# EAGLE design IVSTAGEV15 (EAGLE 5.07)
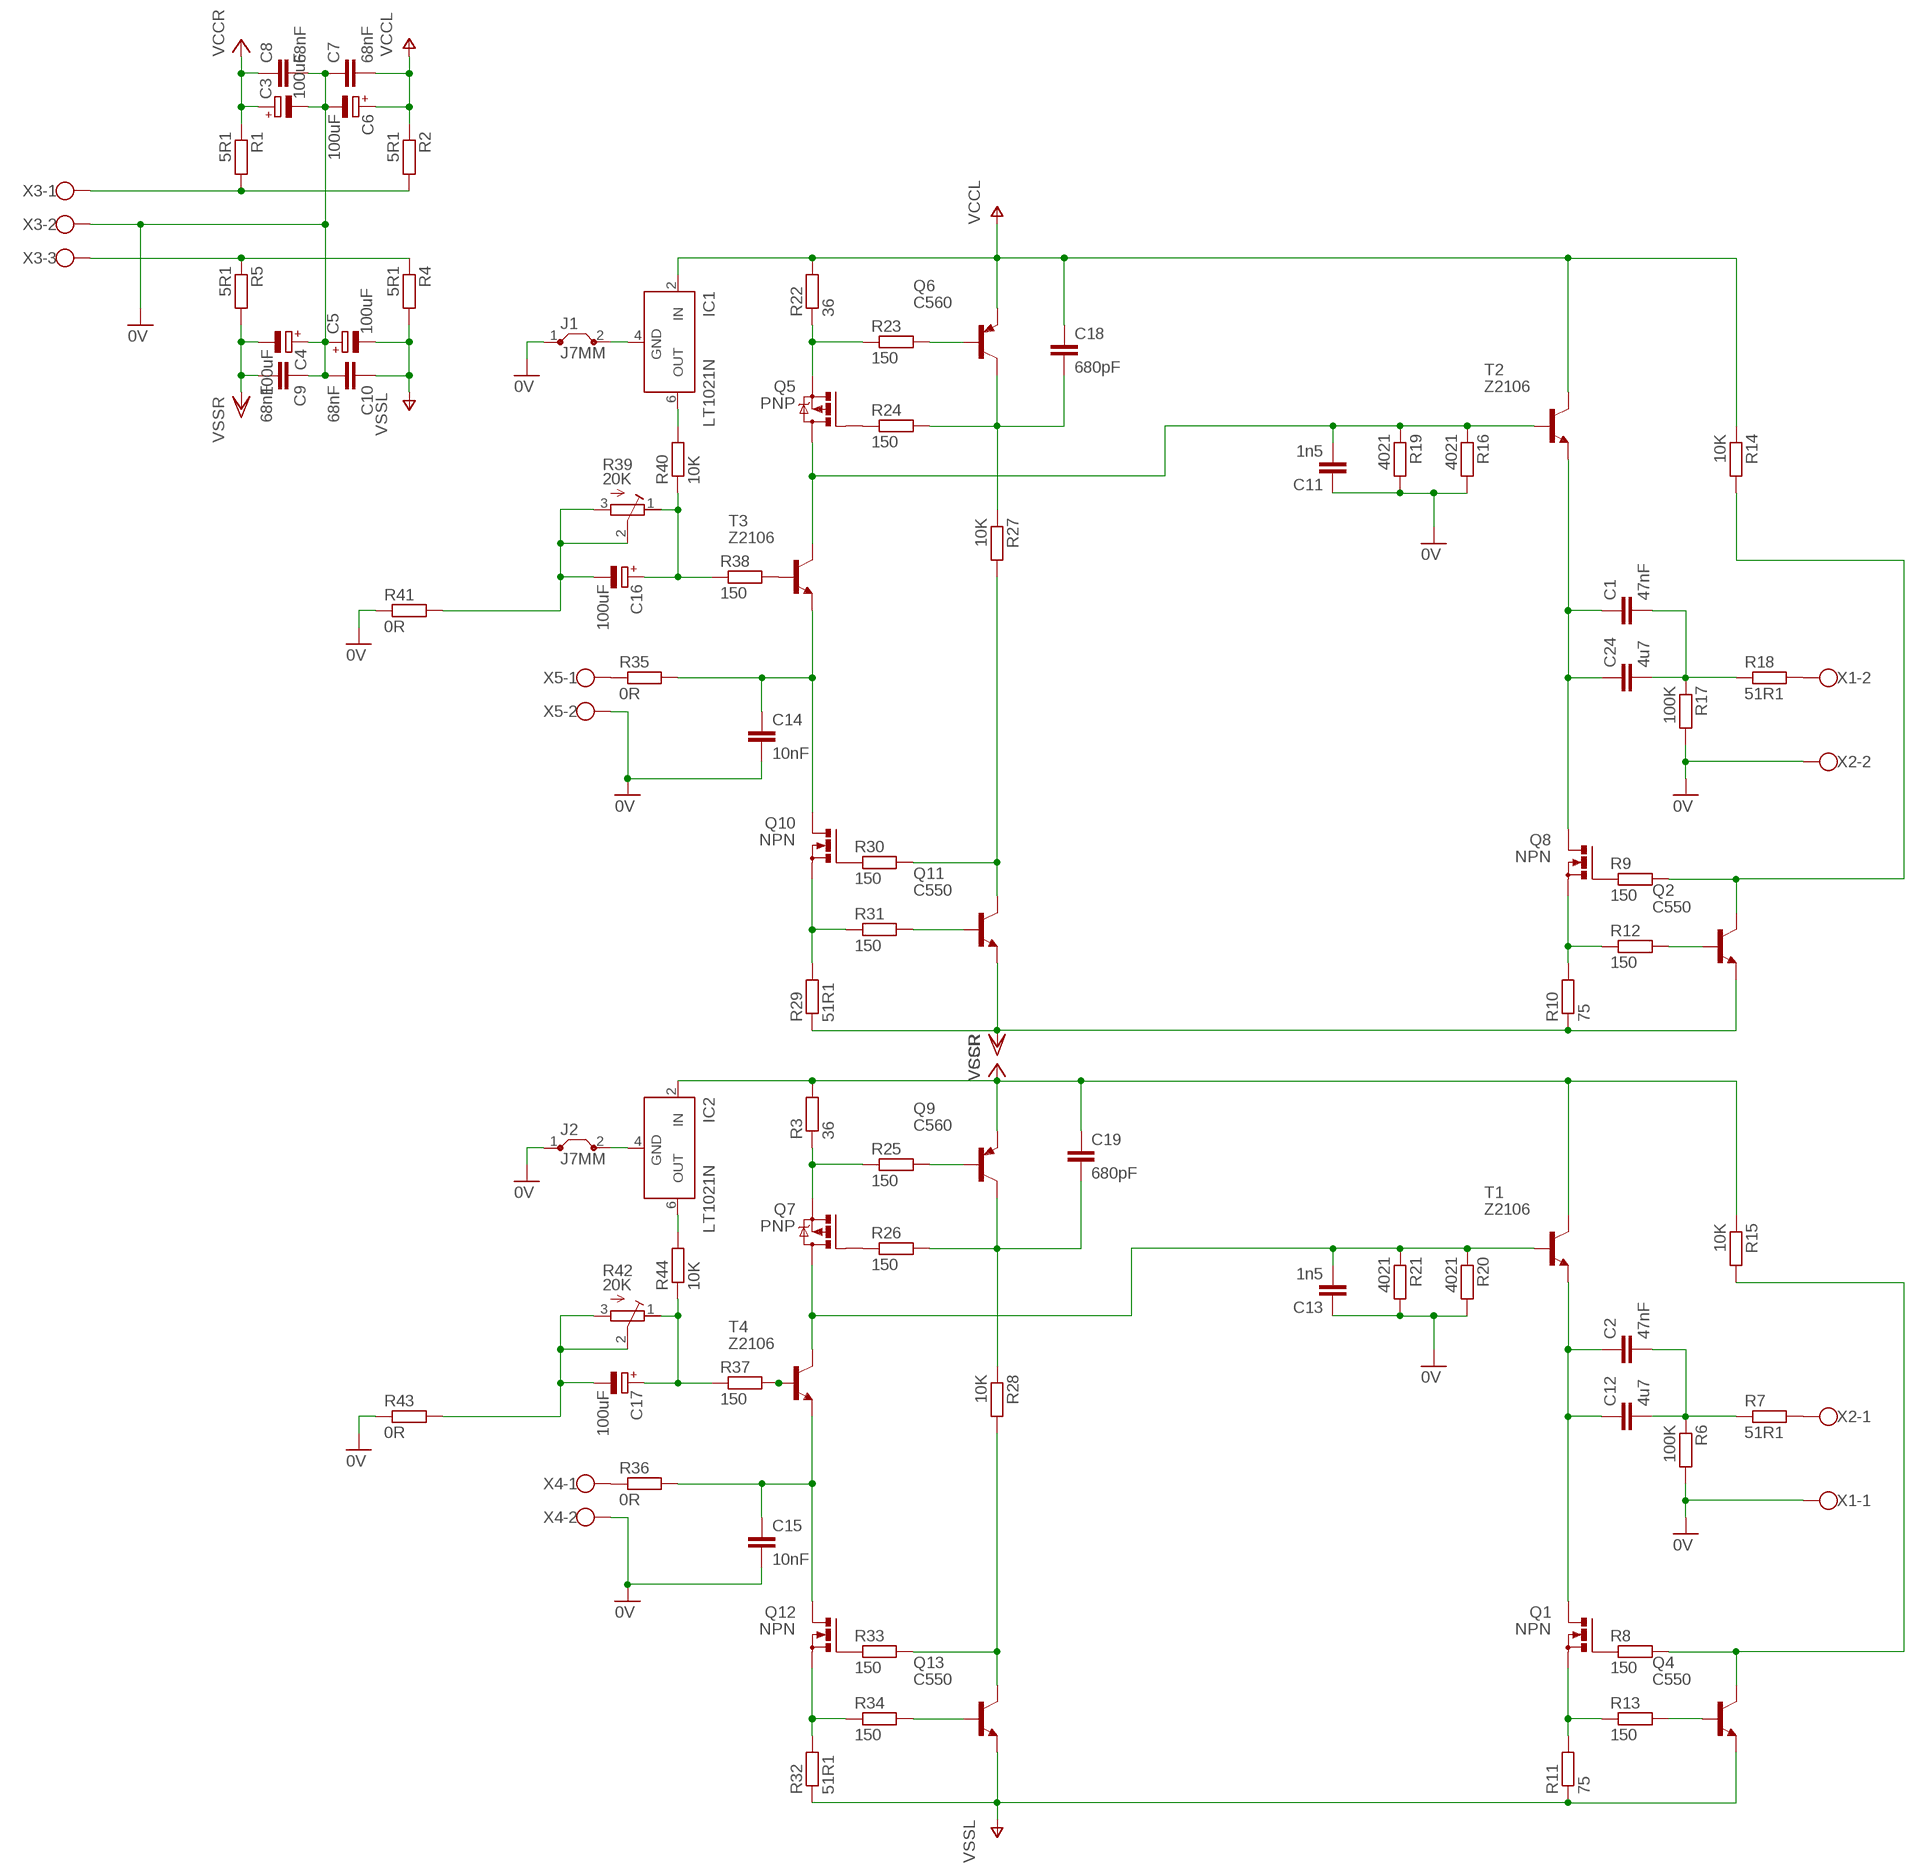
[diagram p0: schematic, sheet 1]

## Parts
C1  47nF  C-EU050-050X075  [C050-050X075]
C2  47nF  C-EU050-050X075  [C050-050X075]
C3  100uF  CPOL-EUE5-13  [E5-13]
C4  100uF  CPOL-EUE5-13  [E5-13]
C5  100uF  CPOL-EUE5-13  [E5-13]
C6  100uF  CPOL-EUE5-13  [E5-13]
C7  68nF  C-EU050-035X075  [C050-035X075]
C8  68nF  C-EU050-035X075  [C050-035X075]
C9  68nF  C-EU050-035X075  [C050-035X075]
C10  68nF  C-EU050-035X075  [C050-035X075]
C11  1n5  C-EU050-035X075  [C050-035X075]
C12  4u7  C37/19  [C37.5B19]
C13  1n5  C-EU050-035X075  [C050-035X075]
C14  10nF  C-EU050-050X075  [C050-050X075]
C15  10nF  C-EU050-050X075  [C050-050X075]
C16  100uF  CPOL-EUE5-10.5  [E5-10,5]
C17  100uF  CPOL-EUE5-10.5  [E5-10,5]
C18  680pF  C-EU050-045X075  [C050-045X075]
C19  680pF  C-EU050-045X075  [C050-045X075]
C24  4u7  C37/19  [C37.5B19]
IC1  LT1021N  [DIL08]
IC2  LT1021N  [DIL08]
J1  J7MM  [07]
J2  J7MM  [07]
Q1  NPN  PMOSFET_NTO220BV  [TO220BV]
Q2  C550  BC550B  [TO92-EBC]
Q4  C550  BC550B  [TO92-EBC]
Q5  PNP  IRF9530  [TO220BV]
Q6  C560  BC560  [TO92-EBC]
Q7  PNP  IRF9530  [TO220BV]
Q8  NPN  PMOSFET_NTO220BV  [TO220BV]
Q9  C560  BC560  [TO92-EBC]
Q10  NPN  PMOSFET_NTO220BV  [TO220BV]
Q11  C550  BC550B  [TO92-EBC]
Q12  NPN  PMOSFET_NTO220BV  [TO220BV]
Q13  C550  BC550B  [TO92-EBC]
R1  5R1  R-EU_0207/7  [0207/7]
R2  5R1  R-EU_0207/7  [0207/7]
R3  36  R-EU_0207/7  [0207/7]
R4  5R1  R-EU_0207/7  [0207/7]
R5  5R1  R-EU_0207/7  [0207/7]
R6  100K  R-EU_0204/7  [0204/7]
R7  51R1  R-EU_0207/7  [0207/7]
R8  150  R-EU_0207/7  [0207/7]
R9  150  R-EU_0207/7  [0207/7]
R10  75  R-EU_0207/7  [0207/7]
R11  75  R-EU_0207/7  [0207/7]
R12  150  R-EU_0207/7  [0207/7]
R13  150  R-EU_0207/7  [0207/7]
R14  10K  R-EU_0309/12  [0309/12]
R15  10K  R-EU_0309/12  [0309/12]
R16  4021  R-EU_0309/12  [0309/12]
R17  100K  R-EU_0204/7  [0204/7]
R18  51R1  R-EU_0207/7  [0207/7]
R19  4021  R-EU_0309/12  [0309/12]
R20  4021  R-EU_0309/12  [0309/12]
R21  4021  R-EU_0309/12  [0309/12]
R22  36  R-EU_0207/7  [0207/7]
R23  150  R-EU_0207/10  [0207/10]
R24  150  R-EU_0207/7  [0207/7]
R25  150  R-EU_0207/10  [0207/10]
R26  150  R-EU_0207/10  [0207/10]
R27  10K  R-EU_0309/12  [0309/12]
R28  10K  R-EU_0309/12  [0309/12]
R29  51R1  R-EU_0207/7  [0207/7]
R30  150  R-EU_0207/7  [0207/7]
R31  150  R-EU_0207/7  [0207/7]
R32  51R1  R-EU_0207/7  [0207/7]
R33  150  R-EU_0207/7  [0207/7]
R34  150  R-EU_0207/7  [0207/7]
R35  0R  R-EU_0207/7  [0207/7]
R36  0R  R-EU_0207/7  [0207/7]
R37  150  R-EU_0204/7  [0204/7]
R38  150  R-EU_0204/7  [0204/7]
R39  20K  R-TRIMMT93YA  [RTRIMT93YA]
R40  10K  R-EU_0207/10  [0207/10]
R41  0R  R-EU_0207/10  [0207/10]
R42  20K  R-TRIMMT93YA  [RTRIMT93YA]
R43  0R  R-EU_0207/10  [0207/10]
R44  10K  R-EU_0207/10  [0207/10]
T1  Z2106  BC337-NPN-TO92-EBC  [TO92-EBC]
T2  Z2106  BC337-40-NPN-TO92-EBC  [TO92-EBC]
T3  Z2106  BC337-NPN-TO92-EBC  [TO92-EBC]
T4  Z2106  BC337-40-NPN-TO92-EBC  [TO92-EBC]
X1  W237-02P  [W237-132]
X2  W237-02P  [W237-132]
X3  W237-03P  [W237-133]
X4  W237-02P  [W237-132]
X5  W237-02P  [W237-132]

## Nets
0V: C3.- C4.+ C5.+ C6.- C7.1 C8.2 C9.1 C10.2 C11.1 C13.1 C14.2 C15.2 J1.1 J2.1 R6.2 R16.2 R17.2 R19.2 R20.2 R21.2 R41.1 R43.1 X1.1 X2.2 X3.2 X4.2 X5.2
N$1: R18.2 X1.2
N$2: R7.2 X2.1
N$3: C2.1 C12.1 Q1.D T1.E
N$4: C1.1 C24.1 Q8.D T2.E
N$5: Q8.S R10.2 R12.1
N$6: R1.2 R2.2 X3.1
N$7: R4.1 R5.1 X3.3
N$8: Q1.S R11.2 R13.1
N$9: Q2.B R12.2
N$11: C2.2 C12.2 R6.1 R7.1
N$12: Q2.C R9.2 R14.2
N$13: Q1.G R8.1
N$14: Q8.G R9.1
N$15: Q4.C R8.2 R15.2
N$16: Q4.B R13.2
N$17: C13.2 Q7.D R20.1 R21.1 T1.B T4.C
N$18: C11.2 Q5.D R16.1 R19.1 T2.B T3.C
N$19: Q6.B R23.2
N$20: C18.2 Q6.C R24.2 R27.1
N$21: Q5.S R22.1 R23.1
N$22: Q7.S R3.1 R25.1
N$23: Q5.G R24.1
N$24: C1.2 C24.2 R17.1 R18.1
N$25: Q7.G R26.1
N$26: Q9.B R25.2
N$27: C19.2 Q9.C R26.2 R28.1
N$28: R38.2 T3.B
N$29: Q12.S R32.2 R34.1
N$30: R35.1 X5.1
N$31: Q10.S R29.2 R31.1
N$32: Q10.G R30.1
N$33: Q11.C R27.2 R30.2
N$34: Q12.G R33.1
N$35: Q11.B R31.2
N$36: Q13.C R28.2 R33.2
N$37: Q13.B R34.2
N$38: R36.1 X4.1
N$39: C14.1 Q10.D R35.2 T3.E
N$40: C15.1 Q12.D R36.2 T4.E
N$41: C16.+ R38.1 R39.1(A) R40.1
N$42: IC1.6(OUT) R40.2
N$43: IC1.4(GND) J1.2
N$44: C17.+ R37.1 R42.1(A) R44.1
N$45: C16.- R39.2(S) R39.3(E) R41.2
N$46: C17.- R42.2(S) R42.3(E) R43.2
N$47: R37.2 T4.B
N$48: IC2.6(OUT) R44.2
N$49: IC2.4(GND) J2.2
V+: C6.+ C7.2 C18.1 IC1.2(IN) Q6.E R2.1 R14.1 R22.2 T2.C ; supply symbol labelled VCCL
V-: C5.- C10.1 Q4.E Q13.E R4.2 R11.1 R32.1 ; supply symbol labelled VSSL
VCC: C3.+ C8.1 C19.1 IC2.2(IN) Q9.E R1.1 R3.2 R15.1 T1.C ; supply symbol labelled VCCR
VSS: C4.- C9.2 Q2.E Q11.E R5.2 R10.1 R29.1 ; supply symbol labelled VSSR

## Library data of the parts
C1 C2 C7-C11 C13-C15 C18 C19 = resistor:C-EU: CAPACITOR, European symbol
C3-C6 C16 C17 = resistor:CPOL-EU: POLARIZED CAPACITOR, European symbol
C12 C24 = capacitor-wima:C: CAPACITOR naming: grid - package width
IC1 IC2 = linear-technology:LT1021: Precision Reference Source: http://www.linear.com/pc/downloadDocument.do?navId=H0,C1,C1010,C1603,P1229,D2805
J1 J2 = jumper:J: Bridge
Q1 Q8 Q10 Q12 = transistor-power:PMOSFET_N: Power MOSFET N-Channel
Q2 Q4 Q11 Q13 = transistor-npn:BC550*: NPN Transistor
Q5 Q7 = transistor-power:IRF9530: P-CHANNEL HEXFET POWER-MOS-FET Source: http://www.irf.com/product-info/datasheets/data/irf9530.pdf
Q6 Q9 = transistor-pnp:BC560*: PNP Transistror
R1-R38 R40 R41 R43 R44 = resistor:R-EU_: RESISTOR, European symbol
R39 R42 = resistor:R-TRIMM: Trimm resistor
T1-T4 = transistor:*-NPN-: NPN Transistror BF959 corrected 2008.03.06
X1 X2 X4 X5 = con-wago-508:W237-02P: WAGO SREW CLAMP
X3 = con-wago-508:W237-03P: WAGO SREW CLAMP

## Board
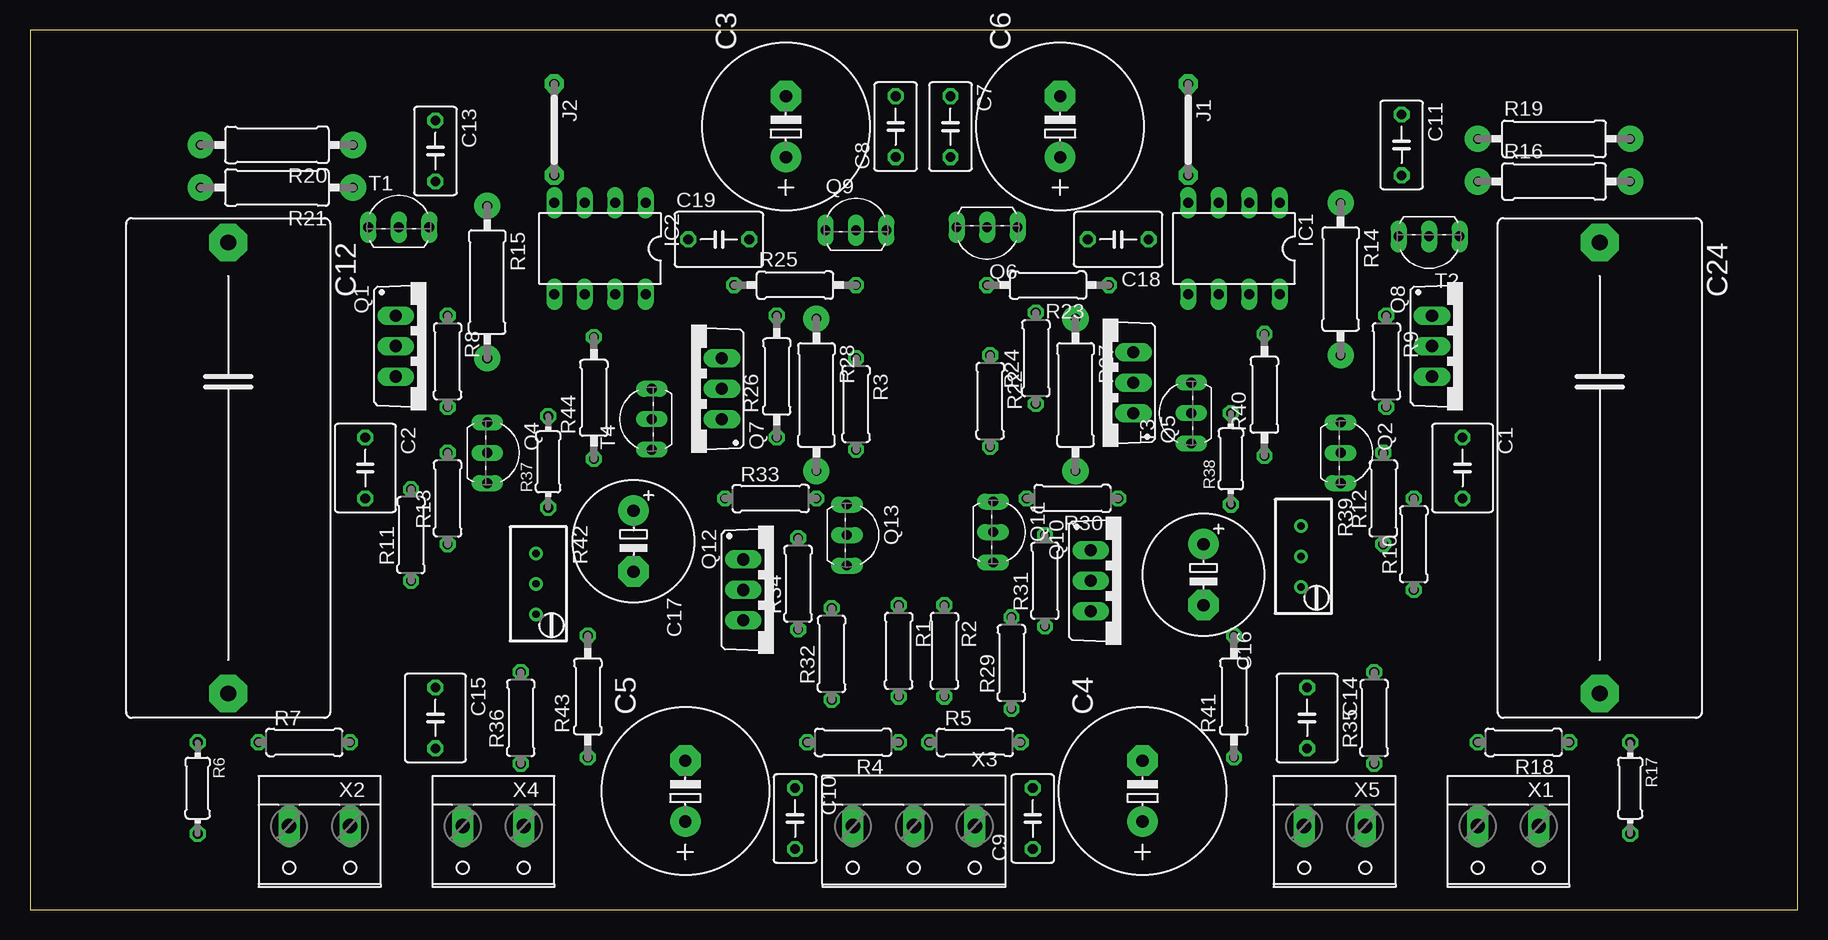
[diagram p1: board, top side]
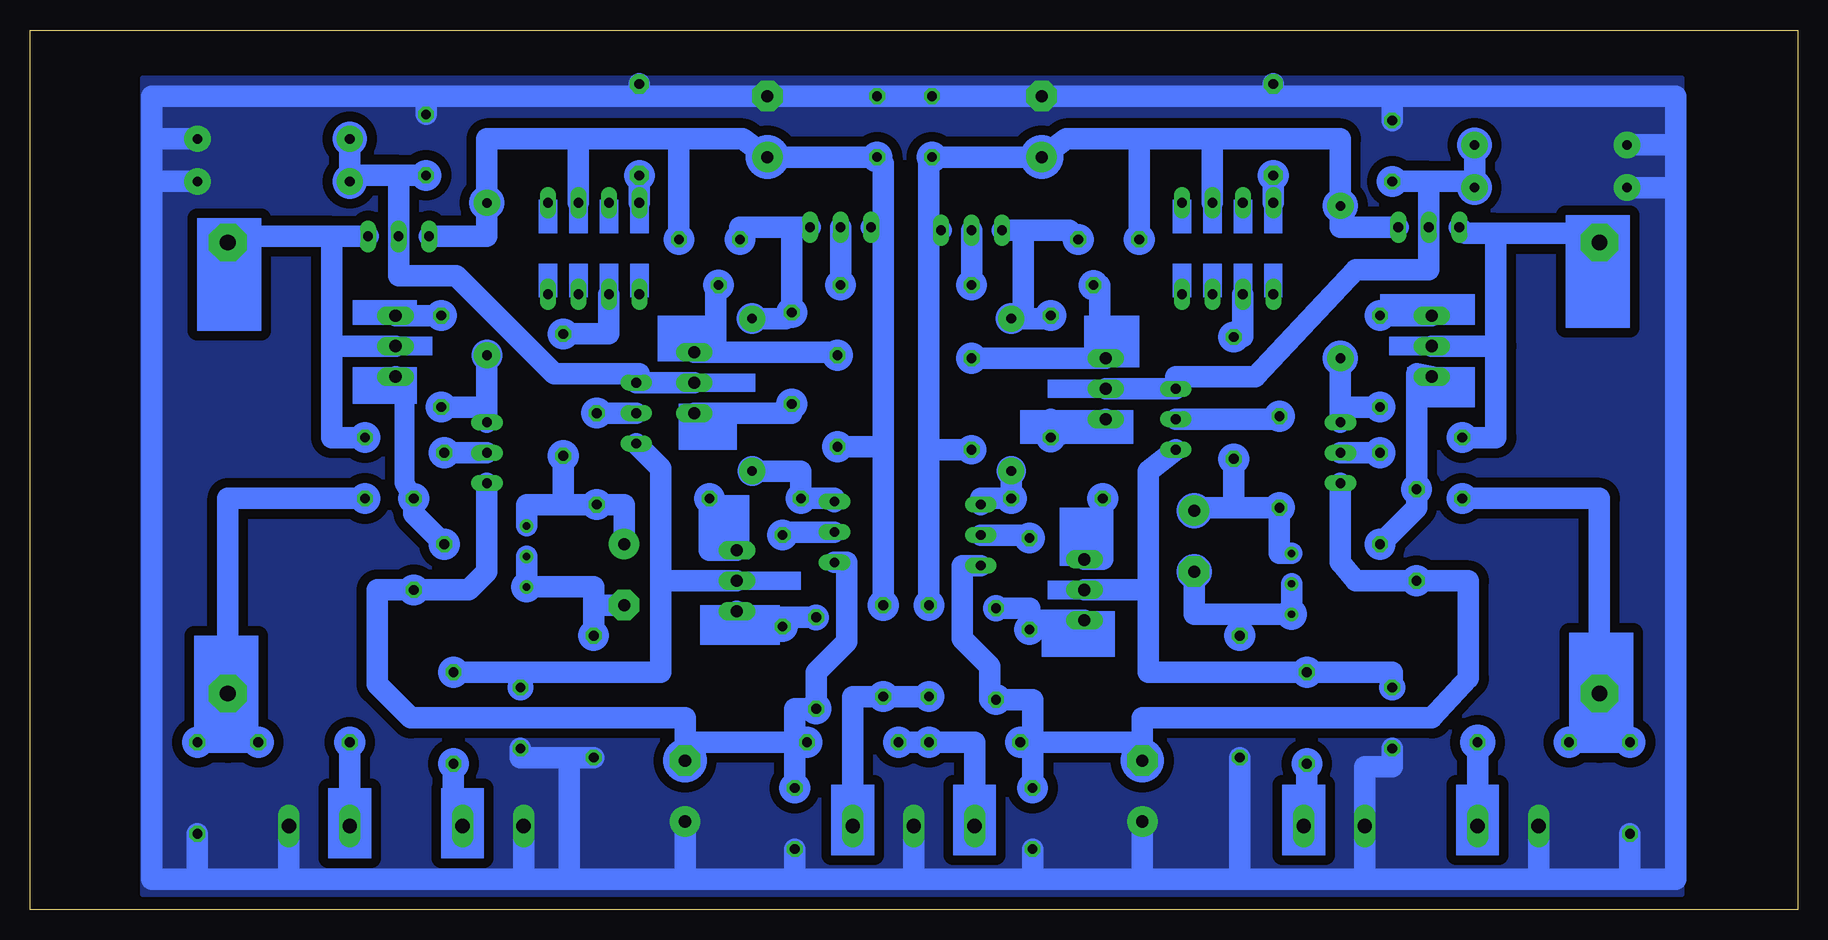
[diagram p2: board, bottom side, seen from below]

Size 147.3 x 73.33 mm. Coordinates in mm from the lower left corner, seen from the top.
Outline: 0,0 147.3,0 147.3,73.33 0,73.33 0,0
Copper layers (1*16): Top 0.035mm / dielectric 1.5mm / Bottom 0.035mm
Design rules "default": minimum track width 10mil, minimum drill 24mil, track to track 8mil, track to pad 8mil, pad to pad 8mil, via to via 8mil, smd to smd 8mil, copper to edge 40mil, drill to drill 8mil, minimum pad ring 10mil, minimum via ring 8mil, stop-mask expansion 4mil, vias tented up to drill 0mil, thermal gap 10mil

### Footprints (pad centres in the part's own frame; a part is rotated, then mirrored left to right if it is on the bottom)
C050-050X075 = drill 0.813 octagon: 1 -2.54,0; 2 2.54,0
E5-13 = drill 1.016 pad 2.54 round: + -2.54,0 | drill 1.016 pad 2.54 octagon: - 2.54,0
C050-035X075 = drill 0.813 octagon: 1 -2.54,0; 2 2.54,0
C37.5B19 = drill 1.321 pad 3.15 octagon: 1 -18.796,0; 2 18.796,0
E5-10,5 = drill 1.016 pad 2.54 round: + -2.54,0 | drill 1.016 pad 2.54 octagon: - 2.54,0
C050-045X075 = drill 0.813 octagon: 1 -2.54,0; 2 2.54,0
DIL08 = drill 0.813 long: 1 -3.81,-3.81; 2 -1.27,-3.81; 3 1.27,-3.81; 4 3.81,-3.81; 5 3.81,3.81; 6 1.27,3.81; 7 -1.27,3.81; 8 -3.81,3.81
07 = drill 0.813 pad 1.6 octagon: 1 -3.81,0; 2 3.81,0
TO220BV = drill 1.016 long: D 0,-2.54; G -2.54,-2.54; S 2.54,-2.54
TO92-EBC = drill 0.813 long: B 0,-1.27; C -2.54,-1.27; E 2.54,-1.27
0207/7 = drill 0.813 octagon: 1 -3.81,0; 2 3.81,0
0204/7 = drill 0.813 octagon: 1 -3.81,0; 2 3.81,0
0309/12 = drill 0.8 pad 2.184 round: 1 -6.35,0; 2 6.35,0
0207/10 = drill 0.813 octagon: 1 -5.08,0; 2 5.08,0
RTRIMT93YA = drill 0.61 round: 1 0,-2.54; 2 0,0; 3 0,2.54
TO92-EBC' = drill 0.813 long: B 0,-1.27; C 2.54,-1.27; E -2.54,-1.27
W237-132 = drill 1.194 long: 1 -2.54,-0.635; 2 2.54,-0.635
W237-133 = drill 1.194 long: 1 -5.08,-0.635; 2 0,-0.635; 3 5.08,-0.635

### Placement (x,y rotation side)
C1  119.38,36.83 270 top
C2  27.94,36.83 270 top
C3  62.99,65.28 90 top
C4  92.71,9.91 90 top
C5  54.61,9.91 90 top
C6  85.85,65.28 90 top
C7  76.71,65.28 270 top
C8  72.14,65.28 90 top
C9  83.57,7.62 90 top
C10  63.75,7.62 270 top
C11  114.3,63.75 270 top
C12  16.51,36.83 270 top
C13  33.78,63.25 270 top
C14  106.43,16 270 top
C15  33.78,16 270 top
C16  97.79,27.94 270 top
C17  50.29,30.73 270 top
C18  90.68,55.88 180 top
C19  57.4,55.88 0 top
C24  130.81,36.83 270 top
IC1  100.33,55.12 180 top
IC2  47.5,55.12 180 top
J1  96.52,65.02 270 top
J2  43.69,65.02 270 top
Q1  33.02,46.99 270 top
Q2  110.49,38.1 270 top
Q4  39.37,38.1 270 top
Q5  89.41,43.94 90 top
Q6  79.76,55.63 180 top
Q7  55.12,43.43 90 top
Q8  119.38,46.99 270 top
Q9  68.83,57.91 0 top
Q10  90.93,27.43 270 top
Q11  81.53,31.5 270 top
Q12  61.98,26.67 270 top
Q13  69.34,31.24 270 top
R1  72.39,21.59 270 top
R2  76.2,21.59 270 top
R3  68.83,42.16 270 top
R4  68.58,13.97 180 top
R5  78.74,13.97 0 top
R6  13.97,10.16 270 top
R7  22.86,13.97 0 top
R8  34.8,45.72 270 top
R9  113.03,45.72 270 top
R10  115.32,30.48 90 top
R11  31.75,31.24 90 top
R12  112.78,34.29 90 top
R13  34.8,34.29 90 top
R14  109.22,52.58 270 top
R15  38.1,52.32 270 top
R16  127,60.71 0 top
R17  133.35,10.16 270 top
R18  124.46,13.97 180 top
R19  127,64.26 0 top
R20  20.57,63.75 180 top
R21  20.57,60.2 180 top
R22  80.01,42.42 270 top
R23  84.84,52.07 180 top
R24  83.82,45.97 90 top
R25  63.75,52.07 0 top
R26  62.23,44.45 90 top
R27  87.12,42.93 270 top
R28  65.53,42.93 270 top
R29  81.79,20.57 90 top
R30  86.87,34.29 180 top
R31  84.58,27.43 90 top
R32  66.8,21.34 90 top
R33  61.72,34.29 0 top
R34  64.01,27.18 90 top
R35  112.01,16 90 top
R36  40.89,16 90 top
R37  43.18,37.34 90 top
R38  100.08,37.59 90 top
R39  105.92,29.46 180 top
R40  102.87,42.93 90 top
R41  100.33,17.78 90 top
R42  42.16,27.18 180 top
R43  46.48,17.78 90 top
R44  46.99,42.67 90 top
T1  Z2106  [TO92-EBC']  30.73,58.17 0 top
T2  Z2106  [TO92-EBC']  116.59,54.86 180 top
T3  Z2106  [TO92-EBC']  95.5,41.4 90 top
T4  Z2106  [TO92-EBC']  50.55,40.89 90 top
X1  123.19,6.35 180 top
X2  24.13,6.35 180 top
X3  73.66,6.35 180 top
X4  38.61,6.35 180 top
X5  108.71,6.35 180 top

### Tracks (layer width: path | path; a pad name or v marks a point on that pad's centre or on a via)
0V
  Bottom 1.778: 13.97,2.54 R6.2 | 13.97,2.54 21.59,2.54 | 21.59,2.54 36.07,2.54 | 36.07,2.54 46.48,2.54 | 46.48,2.54 54.61,2.54 | 54.61,2.54 63.75,2.54 | 63.75,2.54 73.66,2.54 | 73.66,2.54 83.57,2.54 | 83.57,2.54 92.71,2.54 | 92.71,2.54 102.36,2.54 | 102.36,2.54 106.17,2.54 | 106.17,2.54 125.73,2.54 | 125.73,2.54 X1.1 | 133.35,2.54 R17.2 | 125.73,2.54 133.35,2.54 | 21.59,2.54 X2.2 | 54.61,2.54 C5.+ | 73.66,2.54 X3.2 | 92.71,2.54 C4.+ | 96.52,67.82 C6.- C7.1 C8.2 C3.- 43.69,67.82 | 96.52,67.82 114.3,67.82 | 114.3,67.82 137.16,67.82 137.16,64.26 | 137.16,60.71 137.16,2.54 133.35,2.54 | 33.78,67.82 10.16,67.82 10.16,63.75 | 33.78,67.82 43.69,67.82 | 10.16,60.2 10.16,2.54 13.97,2.54 | 10.16,60.2 10.16,63.75 | 63.75,2.54 C10.2 | 83.57,2.54 C9.1 | 10.16,60.2 R21.2 | 10.16,63.75 R20.2 | 33.78,67.82 C13.1 | 114.3,67.82 C11.1 | 137.16,64.26 R19.2 | 137.16,60.71 R16.2 | 137.16,64.26 137.16,60.71 | 36.07,2.54 X4.2 36.07,11.94 33.78,11.94 C15.2 | 106.17,2.54 X5.2 | C14.2 106.43,12.7 R41.1 102.36,12.7 102.36,2.54 | 96.52,67.82 J1.1 | 43.69,67.82 J2.1 | 46.48,2.54 R43.1
  pour Bottom (isolate 0.813, no thermals): 9.65,69.34 9.65,1.27 137.92,1.27 137.92,69.34
N$1
  Bottom 1.778: R18.2 X1.2 120.65,6.35
N$2
  Bottom 1.778: X2.1 R7.2
N$3
  Bottom 1.778: C12.1 16.51,56.39 25.15,56.39 | C2.1 25.15,39.37 25.15,46.99 | 25.15,46.99 25.15,56.39 | 25.15,46.99 Q1.D | T1.E 27.69,56.39 25.15,56.39
N$4
  Bottom 1.778: 122.17,56.13 T2.E | 122.17,56.13 130.81,56.13 C24.1 | C1.1 122.17,39.37 122.17,46.99 | 122.17,46.99 122.17,56.13 | 122.17,46.99 Q8.D
N$5
  Bottom 1.676: R10.2 116.08,35.56 116.08,43.94
  Bottom 1.778: 116.08,43.94 116.84,44.2 Q8.S | R10.2 115.32,33.02 R12.1
N$6
  Bottom 1.778: R1.2 R2.2 78.74,17.78 X3.1
N$7
  Bottom 1.778: R5.1 R4.1 68.58,13.97 X3.3 68.58,6.35
N$8
  Bottom 1.778: Q1.S 31.75,44.7 R11.2 31.75,33.53 R13.1
N$9
  Bottom 1.778: Q2.B R12.2
N$11
  Bottom 1.778: C2.2 16.51,34.29 C12.2 16.51,13.97 | R6.1 16.51,13.97 | 16.51,13.97 R7.1
N$12
  Bottom 1.778: Q2.C 109.22,41.91 | 109.22,41.91 R9.2 | 109.22,41.91 R14.2
N$13
  Bottom 1.778: Q1.G R8.1
N$14
  Bottom 1.778: R9.1 Q8.G
N$15
  Bottom 1.778: R8.2 38.1,41.91 | 38.1,41.91 Q4.C | 38.1,41.91 R15.2
N$16
  Bottom 1.778: R13.2 Q4.B
N$17
  Bottom 1.778: 26.92,60.71 R21.1 | 26.92,60.71 R20.1 | 30.73,60.71 26.92,60.71 | 30.73,60.71 C13.2 | 30.73,60.71 T1.B 30.73,53.34 36.83,53.34 45.21,44.45 51.82,44.45 T4.C Q7.D
N$18
  Bottom 1.778: 120.65,61.21 R16.1 | 120.65,61.21 R19.1 | 116.59,61.21 C11.2 | 116.59,61.21 120.65,61.21 | 116.59,61.21 T2.B 116.59,52.83 111.76,52.83 103.63,44.7 96.52,44.7 T3.C Q5.D
N$19
  Bottom 1.778: R23.2 Q6.B
N$20
  Bottom 1.778: 83.82,56.9 Q6.C | 83.82,56.9 R24.2 84.33,49.28 R27.1 | C18.2 88.14,56.9 83.82,56.9
N$21
  Bottom 1.778: 90.17,46.48 80.01,46.48 R22.1 | 90.17,46.48 Q5.S | R23.1 90.17,51.82 90.17,46.48
N$22
  Bottom 1.778: R25.1 58.17,52.07 58.17,45.97 | Q7.S 58.17,45.97 | 58.17,45.97 R3.1
N$23
  Bottom 1.778: Q5.G 83.82,41.4 R24.1
N$24
  Bottom 1.778: C1.2 130.81,34.29 C24.2 130.81,13.97 | R18.1 130.81,13.97 | 130.81,13.97 R17.1
N$25
  Bottom 1.778: Q7.G R26.1 62.23,40.89
N$26
  Bottom 1.778: R25.2 Q9.B
N$27
  Bottom 1.778: 65.53,49.02 R28.1 64.52,49.28 | R26.2 62.74,49.28 64.52,49.28 | 64.52,56.64 Q9.C | C19.2 60.71,56.64 64.52,56.64 | 64.52,49.28 64.52,56.64
N$28
  Bottom 1.778: T3.B R38.2
N$29
  Bottom 1.778: Q12.S 64.01,24.13 R34.1 64.01,25.15 R32.2
N$30
  Bottom 1.778: X5.1 112.01,6.98 R35.1
N$31
  Bottom 1.778: Q10.S 88.39,24.38 84.58,24.38 | 84.58,24.38 R29.2 | R31.1 84.58,24.38
N$32
  Bottom 1.778: R30.1 90.68,29.97 Q10.G
N$33
  Bottom 1.778: R27.2 83.06,36.58 R30.2 80.26,34.29 Q11.C
N$34
  Bottom 1.778: Q12.G 57.91,29.21 R33.1
N$35
  Bottom 1.778: Q11.B 84.58,31.5 R31.2
N$36
  Bottom 1.778: R28.2 R33.2 68.07,34.29 Q13.C
N$37
  Bottom 1.778: Q13.B 64.01,31.24 R34.2
N$38
  Bottom 1.778: X4.1 40.89,6.98 R36.1
N$39
  Bottom 1.778: T3.E 94.74,36.83 94.74,27.43 | Q10.D 94.74,27.43 | 106.43,19.81 94.74,19.81 94.74,27.43 | 106.43,19.81 R35.2 | 106.43,19.81 C14.1
N$40
  Bottom 1.778: T4.E 54.1,36.58 54.1,26.67 | 54.1,26.67 54.1,19.81 R36.2 33.78,19.81 C15.1 | 54.1,26.67 Q12.D
N$41
  Bottom 1.778: C16.+ 97.79,33.78 R38.1 102.87,33.78 | R39.1 105.92,33.78 102.87,33.78 | 102.87,33.78 R40.1
N$42
  Bottom 1.778: R40.2 99.06,48.01 IC1.6
N$43
  Bottom 1.778: IC1.4 J1.2
N$44
  Bottom 1.778: 46.99,33.53 R37.1 43.18,29.72 R42.1 | 46.99,33.53 50.29,33.53 C17.+ | 46.99,33.53 R44.1
N$45
  Bottom 1.778: R39.2 R39.3 100.33,26.92 100.33,25.4 | 100.33,25.4 C16.- | R41.2 100.33,25.4
N$46
  Bottom 1.778: R42.2 R42.3 46.48,24.64 | 46.48,24.64 50.29,24.64 C17.- | 46.48,24.64 R43.2
N$47
  Bottom 1.778: T4.B 43.18,40.89 R37.2
N$48
  Bottom 1.778: IC2.6 46.23,47.75 R44.2
N$49
  Bottom 1.778: IC2.4 J2.2
V+
  Bottom 1.778: 76.2,56.64 76.2,62.23 C7.2 C6.+ 87.88,64.26 93.22,64.26 | T2.C 109.22,56.13 R14.1 109.22,64.26 101.6,64.26 | 76.2,56.64 Q6.E | R2.1 76.2,38.61 | 76.2,38.61 76.2,56.64 | 101.6,64.26 IC1.2 | 93.22,64.26 C18.1 | 93.22,64.26 101.6,64.26 | 76.2,38.61 R22.2
V-
  Bottom 1.778: 54.61,13.97 63.75,13.97 | 63.75,13.97 R4.2 | 54.61,13.97 C5.- | 63.75,13.97 C10.1 | Q4.E 38.1,28.96 36.83,27.43 R11.1 27.43,27.43 27.43,19.3 30.48,16 54.61,16 54.61,13.97 | 63.75,13.97 63.75,17.53 R32.1 67.31,17.53 67.31,20.32 69.6,22.61 69.6,28.7 Q13.E
VCC
  Bottom 1.778: 72.39,56.64 72.39,62.23 C8.1 C3.+ 60.96,64.26 54.86,64.26 | 72.39,56.64 72.39,38.35 | 72.39,38.35 R1.1 | T1.C 38.1,56.9 R15.1 38.1,64.26 48.77,64.26 | 48.77,64.26 54.86,64.26 | 72.39,56.64 Q9.E | 48.77,64.26 IC2.2 | 54.86,64.26 C19.1 | 72.39,38.35 R3.2
VSS
  Bottom 1.778: 83.57,13.97 R5.2 | 92.71,13.97 C4.- | C9.2 83.57,13.97 | Q2.E 109.22,28.19 110.74,26.67 R10.1 118.36,26.67 118.36,18.8 115.57,16 92.71,16 92.71,13.97 | 83.57,13.97 92.71,13.97 | Q11.E 79.25,28.96 79.25,22.35 81.79,19.81 R29.1 83.57,16.76 83.57,13.97
(copper drawn outside any net)
  shapes: Bottom area x47, Bottom circle x108